# EAGLE design board (EAGLE 9.2.0)

## Sheet 1 of 2: Система питания
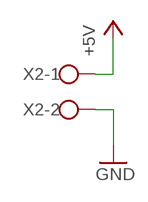
[diagram p0: schematic, sheet 1]

### Parts
X2  W237-102  [W237-102]

### Nets
+5V: X2.1 ; also sheet 2
GND: X2.2 ; also sheet 2

## Sheet 2 of 2
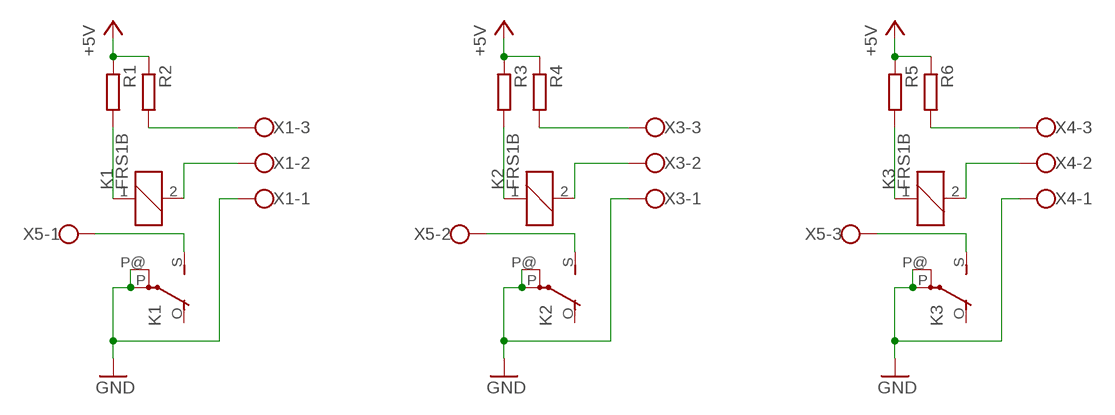
[diagram p1: schematic, sheet 2]

### Parts
K1  FRS1B  [FRS1B]
K2  FRS1B  [FRS1B]
K3  FRS1B  [FRS1B]
R1  R-EU_0207/12  [0207/12]
R2  R-EU_0207/12  [0207/12]
R3  R-EU_0207/12  [0207/12]
R4  R-EU_0207/12  [0207/12]
R5  R-EU_0207/12  [0207/12]
R6  R-EU_0207/12  [0207/12]
X1  W237-103  [W237-103]
X3  W237-103  [W237-103]
X4  W237-103  [W237-103]
X5  W237-103  [W237-103]

### Nets
+5V: R1.1 R2.1 R3.1 R4.1 R5.1 R6.1 ; also sheet 1
GND: K1.P(2:P) K1.P@(2:P) K2.P(2:P) K2.P@(2:P) K3.P(2:P) K3.P@(2:P) X1.1 X3.1 X4.1 ; also sheet 1
N$1: K1.1 R1.2
N$2: R2.2 X1.3
N$3: K1.2 X1.2
N$4: K1.S(2:S) X5.1
N$5: K2.1 R3.2
N$6: R4.2 X3.3
N$7: K2.2 X3.2
N$8: K2.S(2:S) X5.2
N$9: K3.1 R5.2
N$10: R6.2 X4.3
N$11: K3.2 X4.2
N$12: K3.S(2:S) X5.3
Unconnected: K1.O(2:O) K2.O(2:O) K3.O(2:O)

## Library data of the parts
K1-K3 = relay:FRS1B: RELAY 1 x switch, same as V23101-D6-A201, Siemens; OC_FARNELL: unknown; OC_NEWARK: unknown
R1-R6 = rcl:R-EU_: RESISTOR, European symbol; SPICEPREFIX: R
X1 X3-X5 = con-wago-500:W237-103: WAGO SCREW CLAMP; MPN: 237-103; OC_FARNELL: unknown; OC_NEWARK: 18M7116
X2 = con-wago-500:W237-102: WAGO SCREW CLAMP; MPN: 237-102; OC_FARNELL: unknown; OC_NEWARK: 70K9898

## Board
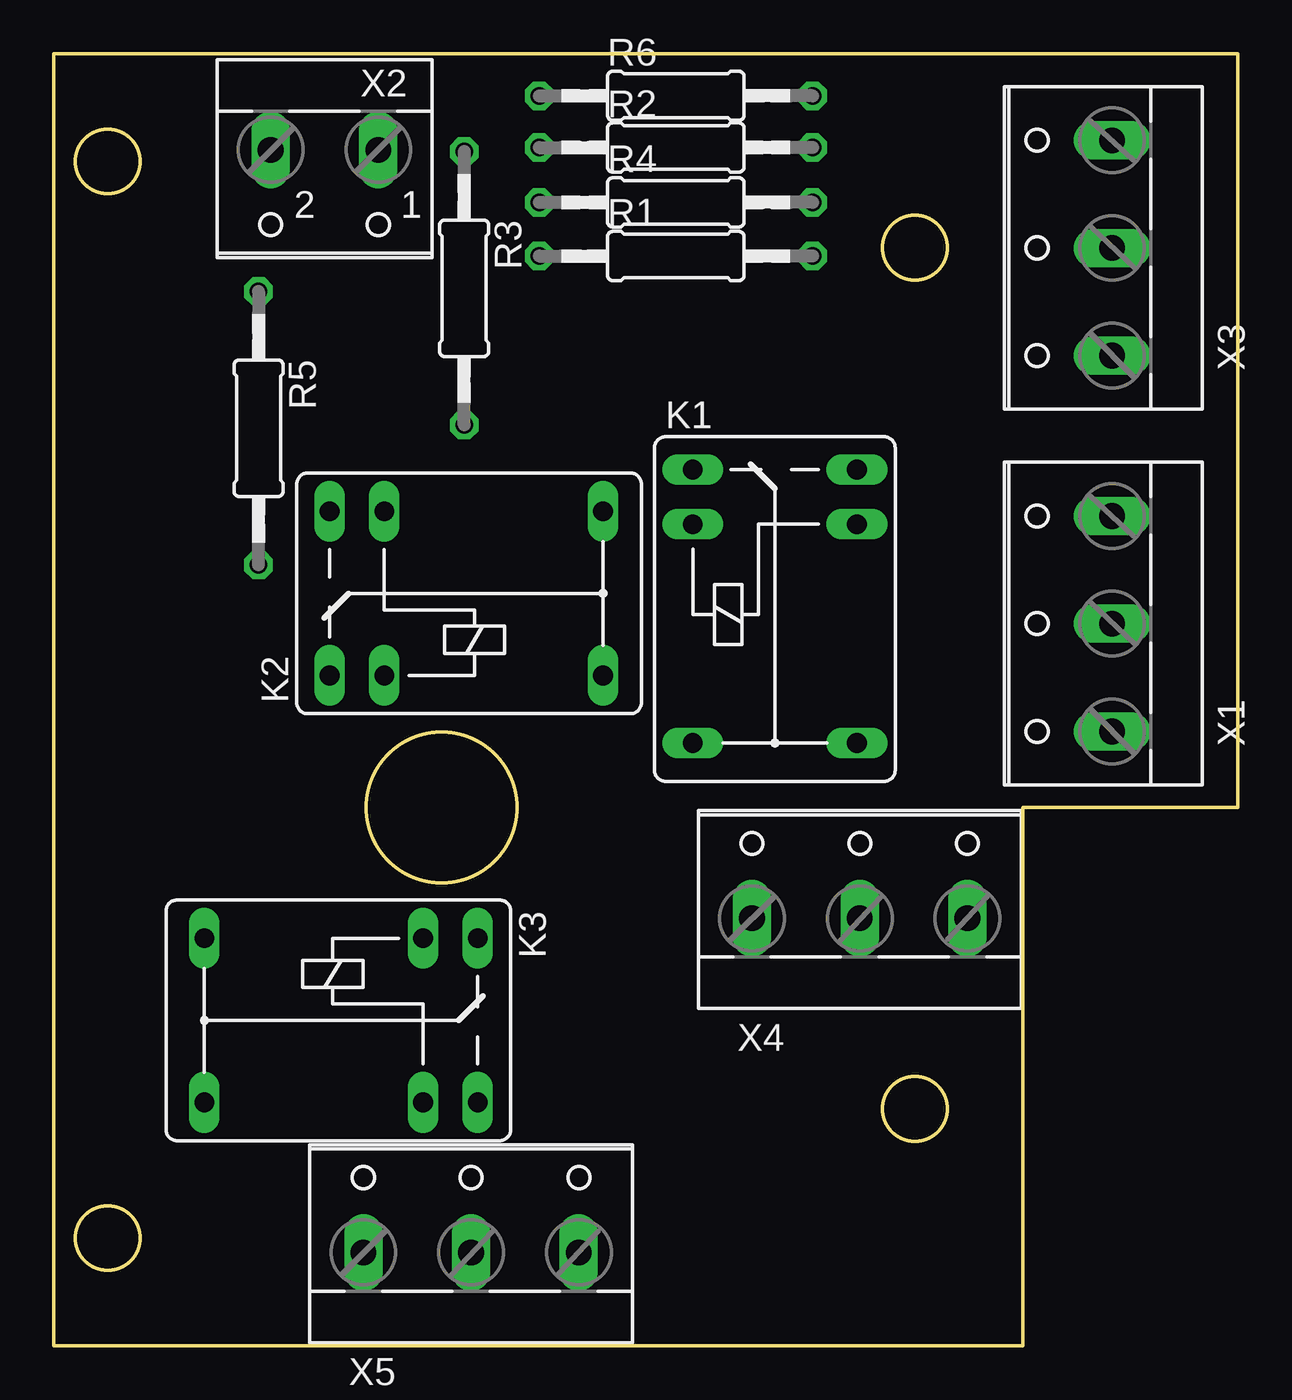
[diagram p2: board, top side]
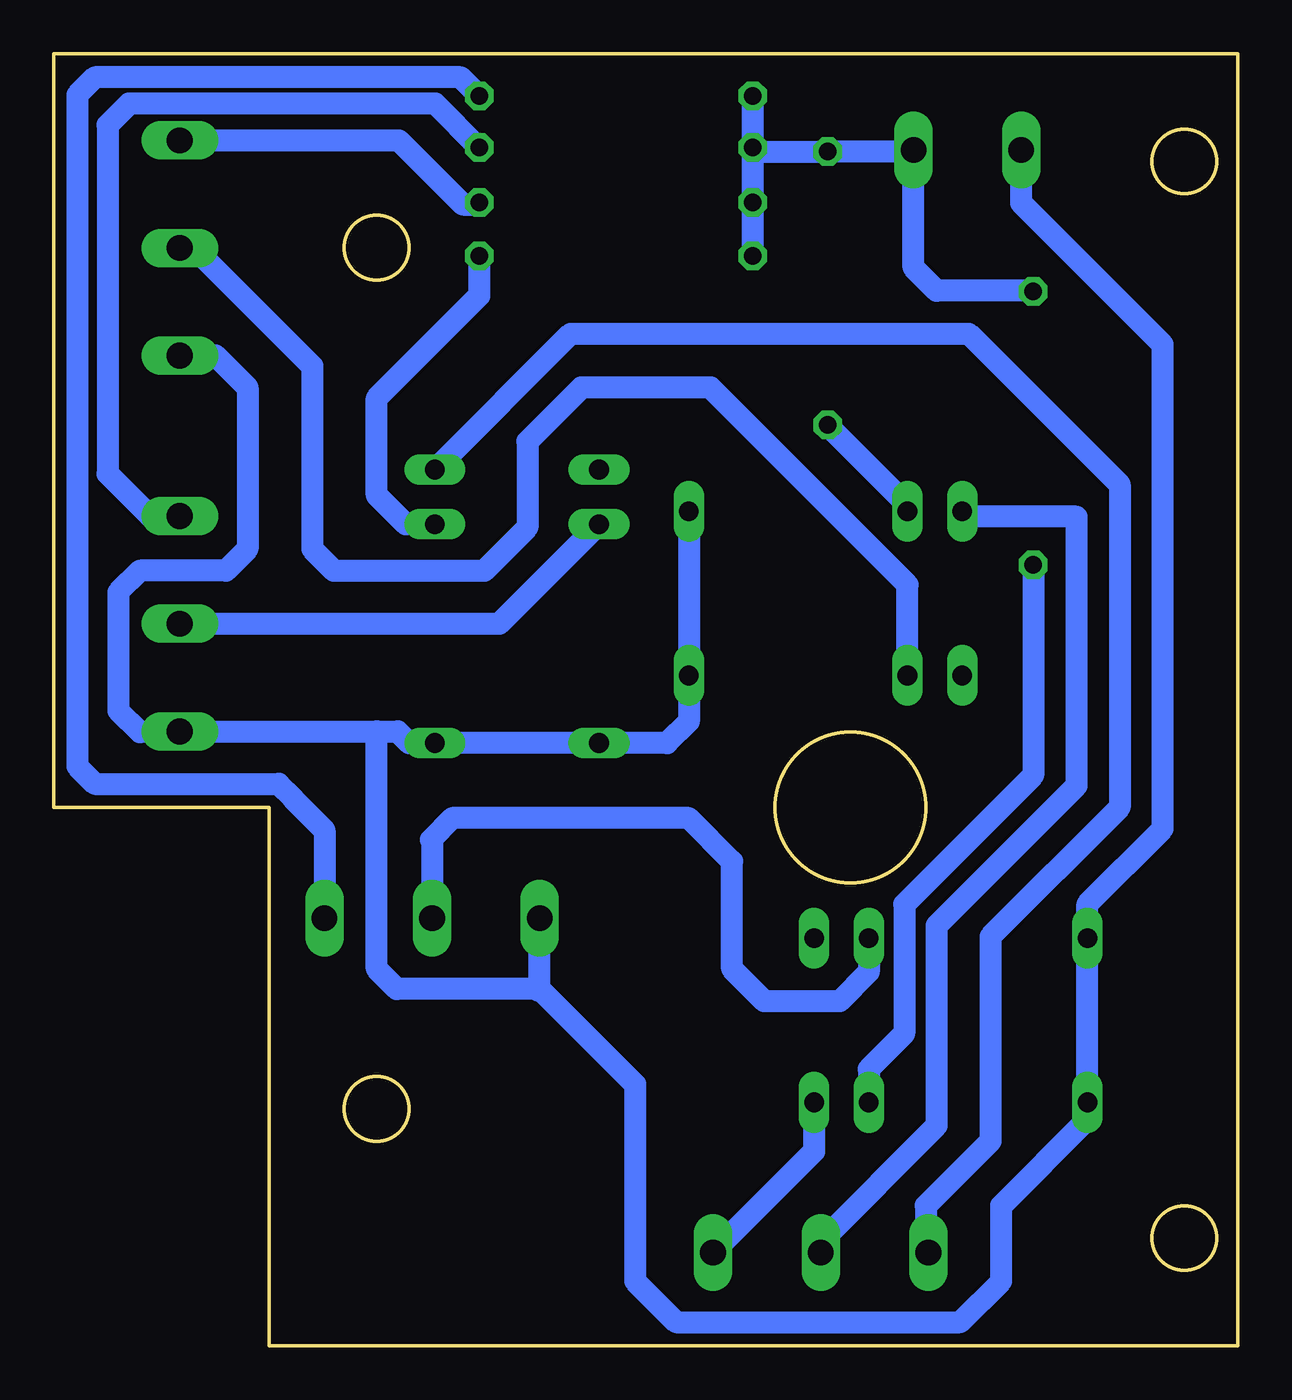
[diagram p3: board, bottom side, seen from below]

Size 55 x 60 mm. Coordinates in mm from the lower left corner, seen from the top.
Outline: 45,0 45,25 55,25 55,60 0,60 0,0 45,0
Outline: circle at 18,25 radius 3.5
Outline: circle at 2.5,5 radius 1.5
Outline: circle at 2.5,55 radius 1.5
Outline: circle at 40,11 radius 1.5
Outline: circle at 40,51 radius 1.5
Copper layers (1*16): Top 0.035mm / dielectric 1.5mm / Bottom 0.035mm
Design rules "default *": minimum track width 6mil, minimum drill 0.35mm, track to track 8mil, track to pad 6mil, pad to pad 6mil, via to via 6mil, smd to smd 6mil, copper to edge 20mil, drill to drill 6mil, minimum pad ring 10mil, minimum via ring 8mil, stop-mask expansion 4mil, vias tented up to drill 0mil, thermal gap 10mil

### Footprints (pad centres in the part's own frame; a part is rotated, then mirrored left to right if it is on the bottom)
FRS1B = drill 0.914 long: 1 0,3.81; 2 0,-3.81; O -2.54,-3.81; P 10.16,3.81; P@ 10.16,-3.81; S -2.54,3.81
0207/12 = drill 0.813 octagon: 1 -6.35,0; 2 6.35,0
W237-103 = drill 1.194 long: 1 -5,-1.29; 2 0,-1.29; 3 5,-1.29
W237-102 = drill 1.194 long: 1 -2.5,-1.27; 2 2.5,-1.27

### Placement (x,y rotation side)
K1  33.49,38.15 270 top
K2  15.35,34.94 0 top
K3  17.15,15.11 180 top
R1  28.89,50.61 0 top
R2  28.89,55.65 0 top
R3  19.06,49.11 270 top
R4  28.89,53.1 0 top
R5  9.51,42.61 270 top
R6  28.89,58.05 0 top
X1  47.86,33.53 90 top
X2  12.57,54.27 180 top
X3  47.86,50.98 90 top
X4  37.43,21.14 0 top
X5  19.38,5.62 0 top

### Tracks (layer width: path | path; a pad name or v marks a point on that pad's centre or on a via)
+5V
  Bottom 1.016: R6.1 R2.1 | R2.1 R4.1 R1.1 | R2.1 22.35,55.46 R3.1 15.15,55.46 X2.1 15.07,50.07 14,49 9.55,49 R5.1
GND
  Bottom 1.016: X3.1 47.52,45.98 47.5,46 46,44.5 46,37 47,36 51,36 52,35 52,29.5 51,28.5 50.97,28.53 X1.1 40,28.53 | K2.P K2.P@ 25.51,28.99 26.51,27.99 K1.P@ K1.P 38.49,27.99 39.03,28.53 40,28.53 | 32.5,16.5 32.43,16.57 | 32.43,16.57 X4.1 | 32.43,16.57 39.07,16.57 40,17.5 40,28.53 | 32.43,16.57 28,12.14 28,3 26.09,1.09 12.91,1.09 11,3 11,6.5 6.99,10.51 K3.P K3.P@ 6.99,20.51 3.5,24 3.5,46.5 10.07,53.07 X2.2
N$1
  Bottom 1.016: R1.2 35.24,48.76 40,44 40,39.5 38.65,38.15 K1.1
N$2
  Bottom 1.016: R2.2 37.28,57.69 51.5,57.69 52.5,56.69 52.5,40.5 50.5,38.5 50.47,38.53 X1.3
N$3
  Bottom 1.016: X1.2 34.3,33.53 K1.2
N$4
  Bottom 1.016: K1.S 30.99,47 12.5,47 5.5,40 5.5,25 11.5,19 11.5,9.5 14.5,6.5 14.5,4.45 X5.1
N$5
  Bottom 1.016: R3.2 15.35,39.05 K2.1
N$6
  Bottom 1.016: X3.3 38.98,55.98 36,53 35.34,53 R4.2
N$7
  Bottom 1.016: X3.2 48.48,50.98 43,45.5 43,37 42,36 35,36 33,38 33,42 30.5,44.5 24.5,44.5 15.35,35.35 K2.2
N$8
  Bottom 1.016: X5.2 19.38,4.83 14,10.21 14,19.5 7.5,26 7.5,38.5 12.56,38.5 K2.S
N$9
  Bottom 1.016: R5.2 9.51,26.49 15.5,20.5 15.5,14.5 17.15,12.85 K3.1
N$10
  Bottom 1.016: R6.2 36.1,58.91 53.09,58.91 53.91,58.09 53.91,26.91 53.09,26.09 44.55,26.09 43.91,25.45 43.91,25.41 42.43,23.93 X4.3
N$11
  Bottom 1.016: K3.2 17.15,17.35 18.5,16 22,16 23.5,17.5 23.5,22.5 25.5,24.5 36.5,24.5 37.5,23.5 37.43,23.43 X4.2
N$12
  Bottom 1.016: K3.S 19.69,9.02 X5.3